# EAGLE design oscilloscope (EAGLE 9.6.2)
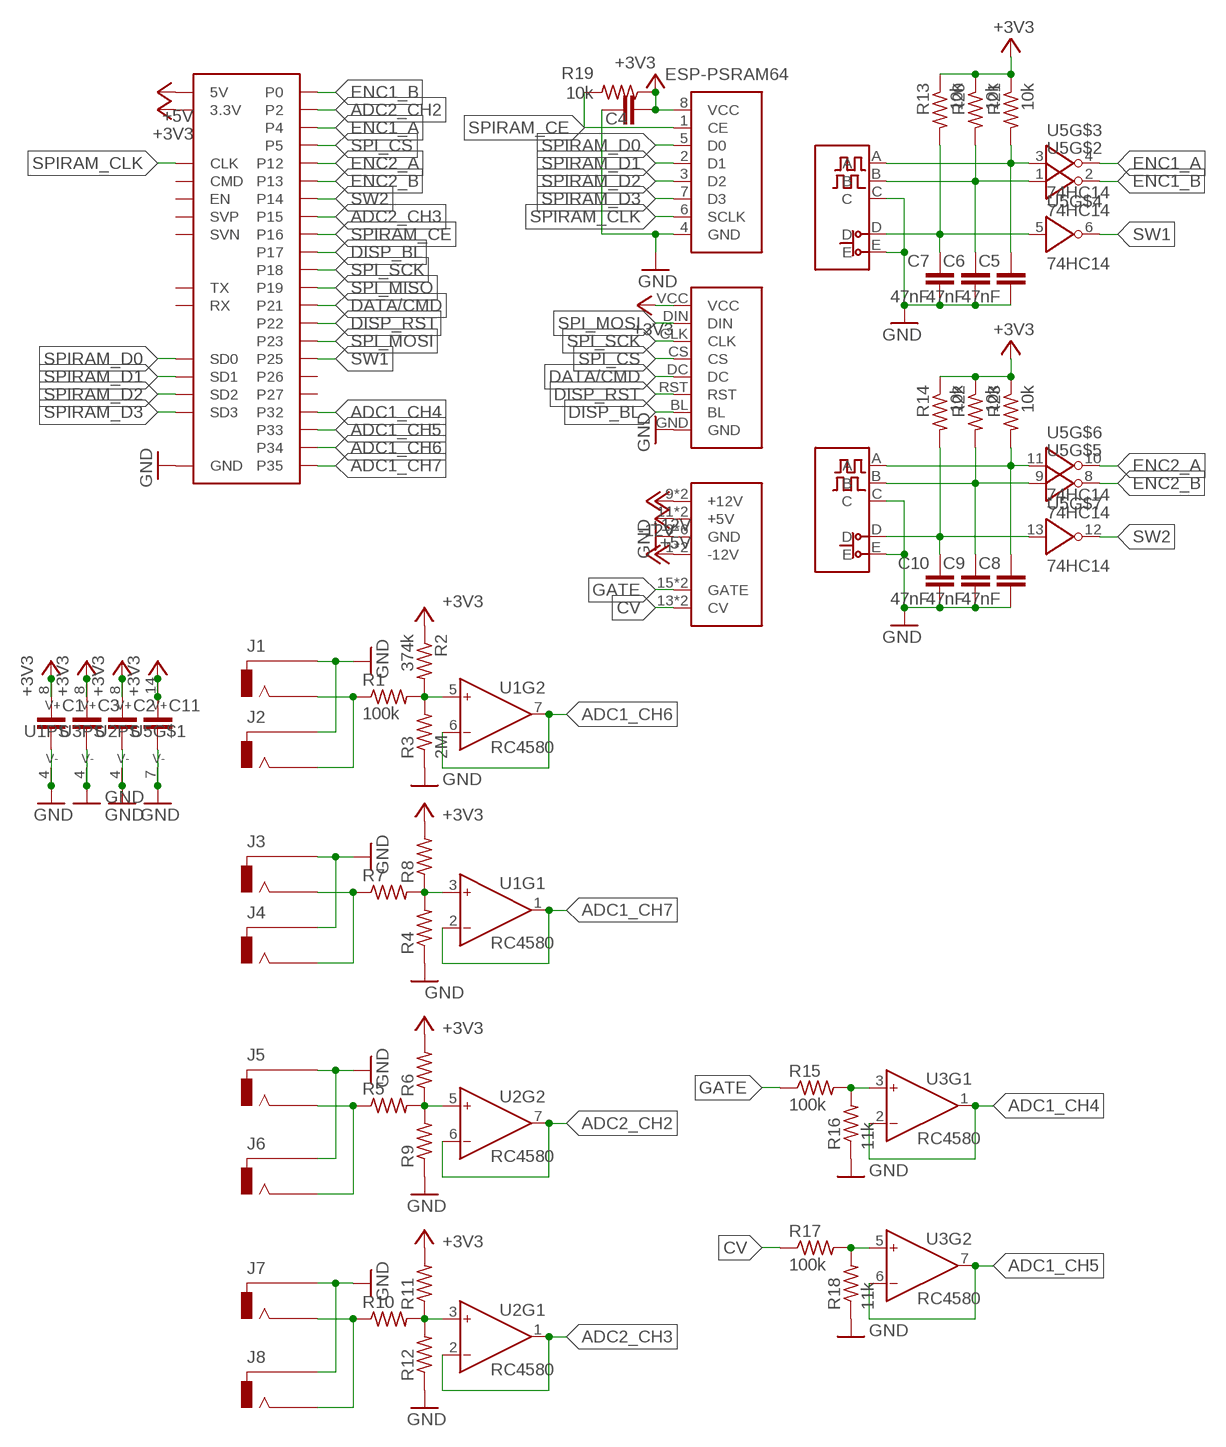
[diagram p0: schematic, sheet 1]

## Parts
C1  C-EUC0805  [C0805]
C2  C-EUC0805  [C0805]
C3  C-EUC0805  [C0805]
C4  C-EUC0805  [C0805]
C5  47nF  C-EUC0805  [C0805]
C6  47nF  C-EUC0805  [C0805]
C7  47nF  C-EUC0805  [C0805]
C8  47nF  C-EUC0805  [C0805]
C9  47nF  C-EUC0805  [C0805]
C10  47nF  C-EUC0805  [C0805]
C11  C-EUC0805  [C0805]
DS1  ST27789_DISPLAY  [ST7789_DISPLAY]
J1  35PM1  [35PM1]
J2  35PM1  [35PM1]
J3  35PM1  [35PM1]
J4  35PM1  [35PM1]
J5  35PM1  [35PM1]
J6  35PM1  [35PM1]
J7  35PM1  [35PM1]
J8  35PM1  [35PM1]
M1  ESP32  [ESP32]
R1  100k  R-US_R0805  [R0805]
R2  374k  R-US_R0805  [R0805]
R3  2M  R-US_R0805  [R0805]
R4  R-US_R0805  [R0805]
R5  R-US_R0805  [R0805]
R6  R-US_R0805  [R0805]
R7  R-US_R0805  [R0805]
R8  R-US_R0805  [R0805]
R9  R-US_R0805  [R0805]
R10  R-US_R0805  [R0805]
R11  R-US_R0805  [R0805]
R12  R-US_R0805  [R0805]
R13  10k  R-US_R0805  [R0805]
R14  10k  R-US_R0805  [R0805]
R15  100k  R-US_R0805  [R0805]
R16  11k  R-US_R0805  [R0805]
R17  100k  R-US_R0805  [R0805]
R18  11k  R-US_R0805  [R0805]
R19  10k  R-US_R0805  [R0805]
R20  10k  R-US_R0805  [R0805]
R21  10k  R-US_R0805  [R0805]
R22  10k  R-US_R0805  [R0805]
R23  10k  R-US_R0805  [R0805]
SW1  EN12-HS  [EN12-HS]
SW2  EN12-HS  [EN12-HS]
U1  RC4580  [SOIC-8]
U2  RC4580  [SOIC-8]
U3  RC4580  [SOIC-8]
U4  ESP-PSRAM64  [SOIC-8]
U5  74HC14  [SOIC127P600X175-14N]
U$1  EURORACK  [302-S161]

## Nets
+3V3: C1.1 C2.1 C3.1 C4.2 C11.1 DS1.VCC M1.X0(3.3V) R2.1 R6.2 R8.2 R11.2 R13.1 R14.1 R19.1 R20.1 R21.1 R22.1 R23.1 U1.8(PS:V+) U2.8(PS:V+) U3.8(PS:V+) U4.8(VCC) U5.14(V+)
+5V: M1.X18(5V) U$1.11(+5V) U$1.12(+5V)
+12V: U$1.9(+12V) U$1.10(+12V)
-12V: U$1.1(-12V) U$1.2(-12V)
ADC1_CH4: M1.X6(P32) U3.1(OUT) U3.2(IN-)
ADC1_CH5: M1.X7(P33) U3.6(IN-) U3.7(OUT)
ADC1_CH6: M1.X4(P34) U1.6(IN-) U1.7(OUT)
ADC1_CH7: M1.X5(P35) U1.1(OUT) U1.2(IN-)
ADC2_CH2: M1.X23(P2) U2.6(IN-) U2.7(OUT)
ADC2_CH3: M1.X22(P15) U2.1(OUT) U2.2(IN-)
CV: R17.1 U$1.13(CV) U$1.14(CV)
DATA/CMD: DS1.DC M1.X32(P21)
DISP_BL: DS1.BL M1.X27(P17)
DISP_RST: DS1.RST M1.X35(P22)
ENC1_A: M1.X25(P4) U5.4(O)
ENC1_A_I: C5.1 R21.2 SW1.A U5.3(I)
ENC1_B: M1.X24(P0) U5.2(O)
ENC1_B_I: C6.1 R20.2 SW1.B U5.1(I)
ENC2_A: M1.X12(P12) U5.10(O)
ENC2_A_I: C8.1 R23.2 SW2.A U5.11(I)
ENC2_B: M1.X14(P13) U5.8(O)
ENC2_B_I: C9.1 R22.2 SW2.B U5.9(I)
GATE: R15.1 U$1.15(GATE) U$1.16(GATE)
GND: C1.2 C2.2 C3.2 C4.1 C5.2 C6.2 C7.2 C8.2 C9.2 C10.2 C11.2 DS1.GND J1.SLEEVE J2.SLEEVE J3.SLEEVE J4.SLEEVE J5.SLEEVE J6.SLEEVE J7.SLEEVE J8.SLEEVE M1.X13(GND) M1.X31(GND) M1.X37(GND) R3.1 R4.1 R9.1 R12.1 R16.1 R18.1 SW1.C SW1.E SW2.C SW2.E U1.4(PS:V-) U2.4(PS:V-) U3.4(PS:V-) U4.4(GND) U5.7(V-) U$1.3(GND) U$1.4(GND) U$1.5(GND) U$1.6(GND) U$1.7(GND) U$1.8(GND)
N$1: R1.2 R2.2 R3.2 U1.5(IN+)
N$2: J1.TIP J2.TIP R1.1
N$3: J3.TIP J4.TIP R7.1
N$4: R5.2 R6.1 R9.2 U2.5(IN+)
N$5: J5.TIP J6.TIP R5.1
N$6: R4.2 R7.2 R8.1 U1.3(IN+)
N$7: R10.2 R11.1 R12.2 U2.3(IN+)
N$8: J7.TIP J8.TIP R10.1
N$9: R15.2 R16.2 U3.3(IN+)
N$11: R17.2 R18.2 U3.5(IN+)
SPI_CS: DS1.CS M1.X28(P5)
SPI_MISO: M1.X30(P19)
SPI_MOSI: DS1.DIN M1.X36(P23)
SPI_SCK: DS1.CLK M1.X29(P18)
SPIRAM_CE: M1.X26(P16) R19.2 U4.1(CE)
SPIRAM_CLK: M1.X19(CLK) U4.6(SCLK)
SPIRAM_D0: M1.X20(SD0) U4.5(D0)
SPIRAM_D1: M1.X21(SD1) U4.2(D1)
SPIRAM_D2: M1.X15(SD2) U4.3(D2)
SPIRAM_D3: M1.X16(SD3) U4.7(D3)
SW1: M1.X8(P25) U5.6(O)
SW1_I: C7.1 R13.2 SW1.D U5.5(I)
SW2: M1.X11(P14) U5.12(O)
SW2_I: C10.1 R14.2 SW2.D U5.13(I)
Unconnected: M1.X1(EN) M1.X2(SVP) M1.X3(SVN) M1.X9(P26) M1.X10(P27) M1.X17(CMD) M1.X33(RX) M1.X34(TX)

## Library data of the parts
C1-C11 = rcl:C-EU: CAPACITOR, European symbol; SPICEPREFIX: C
DS1 = artysynth:ST27789_DISPLAY
J1-J8 = artysynth:35PM1
M1 = artysynth:ESP32
R1-R23 = rcl:R-US_: RESISTOR, American symbol; SPICEPREFIX: R
SW1 SW2 = artysynth:EN12-HS
U1-U3 = artysynth:RC4580
U4 = artysynth:ESP-PSRAM64
U5 = artysynth:74HC14
U$1 = artysynth:EURORACK

## Board
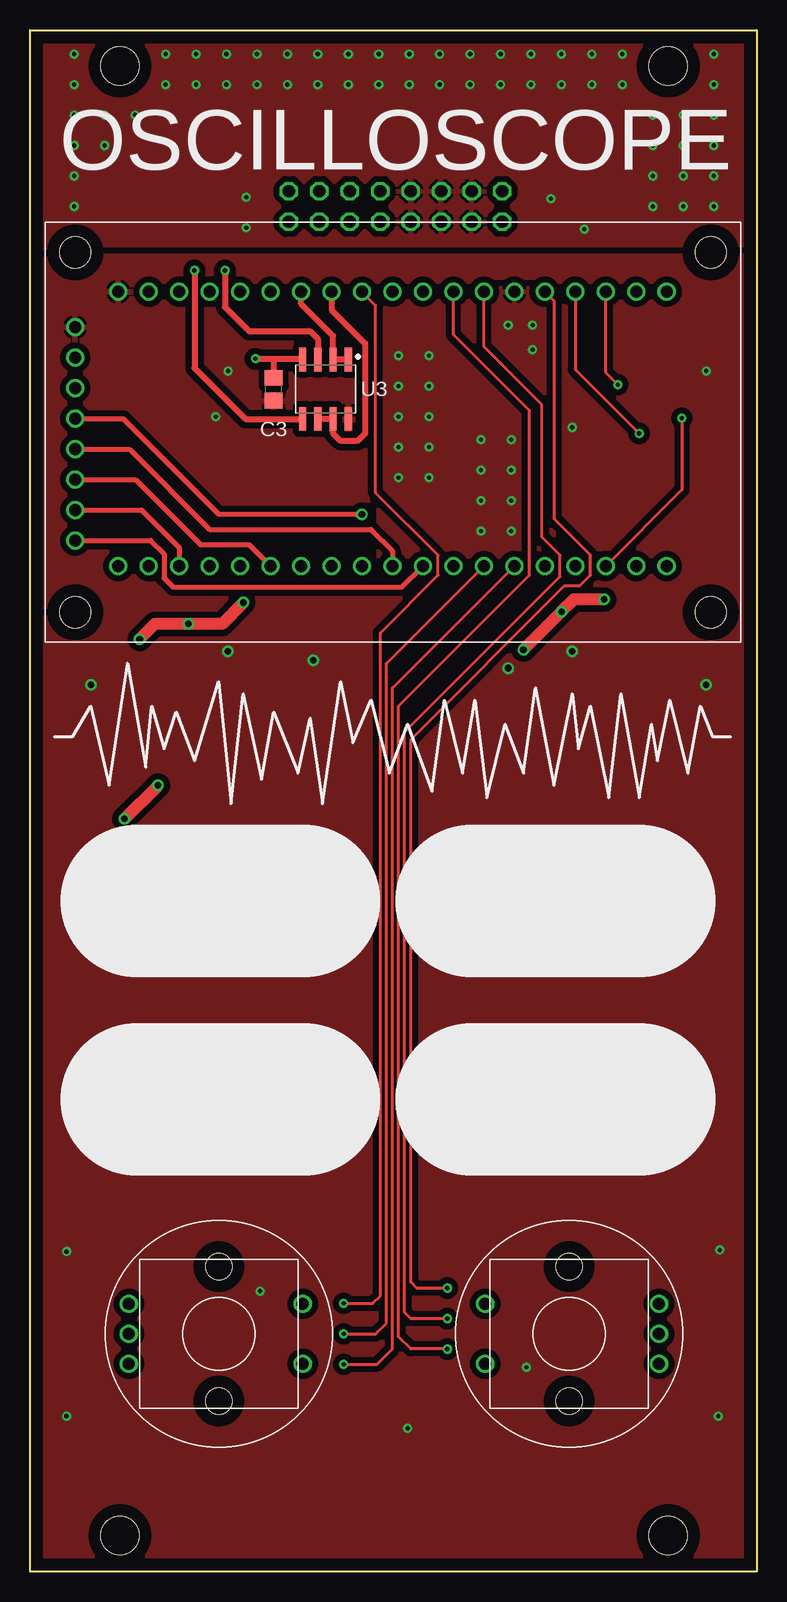
[diagram p1: board, top side]
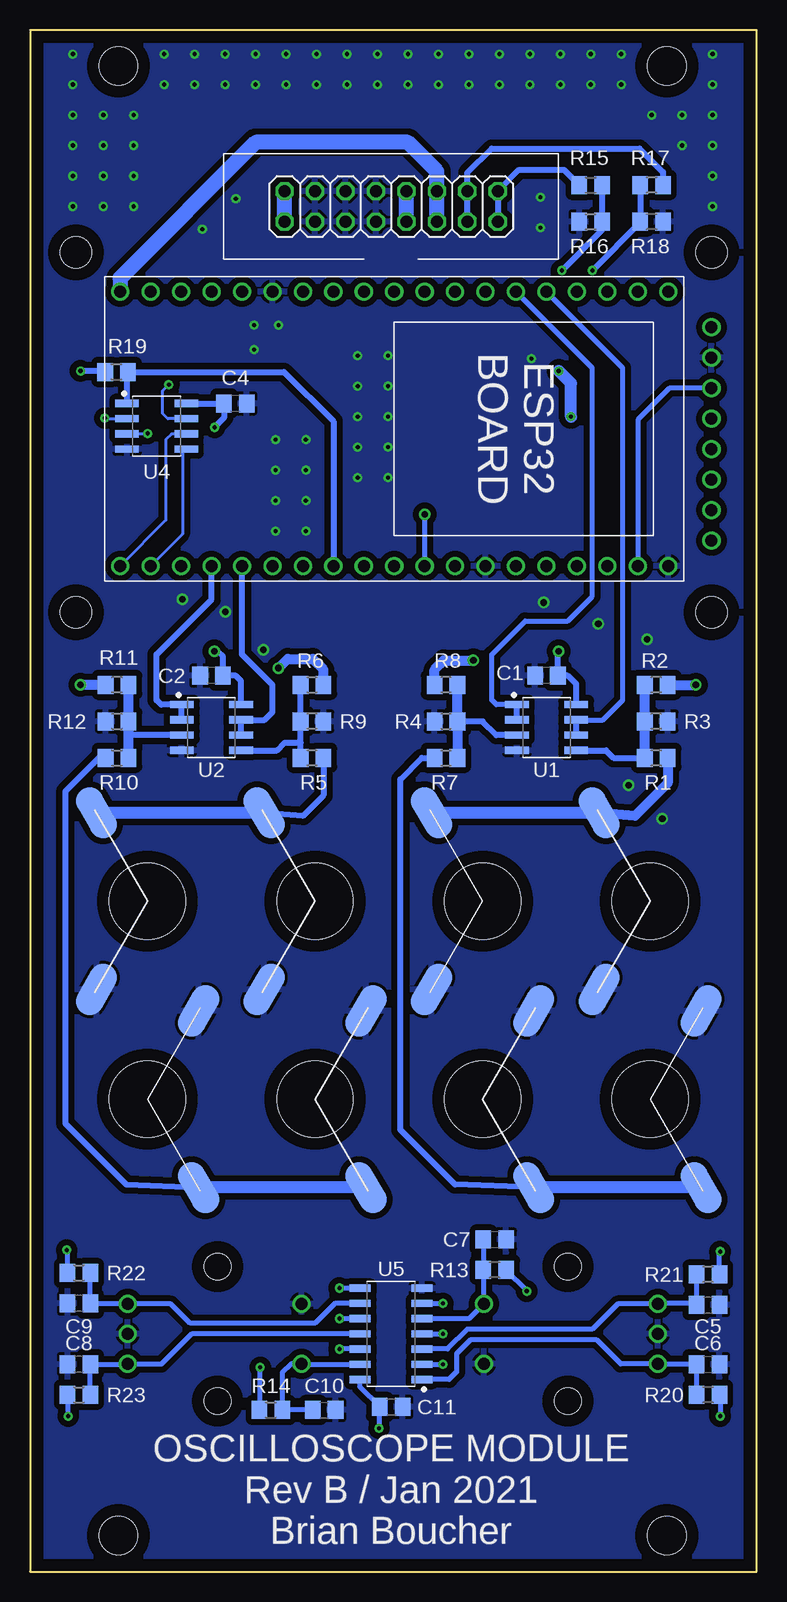
[diagram p2: board, bottom side, seen from below]

Size 60.6 x 128.5 mm. Coordinates in mm from the lower left corner, seen from the top.
Outline: 0,0 0,128.5 60.6,128.5 60.6,0 0,0
Copper layers (1*16): Top 0.035mm / dielectric 1.5mm / Bottom 0.035mm
Design rules "default *": minimum track width 6mil, minimum drill 0.35mm, track to track 6mil, track to pad 6mil, pad to pad 6mil, via to via 6mil, smd to smd 6mil, copper to edge 40mil, drill to drill 6mil, minimum pad ring 10mil, minimum via ring 8mil, stop-mask expansion 4mil, vias tented up to drill 25mil, thermal gap 10mil
Holes 3.2 mm at 7.5,125.5 53.22,125.5 7.5,3 53.22,3

### Footprints (pad centres in the part's own frame; a part is rotated, then mirrored left to right if it is on the bottom)
C0805 = smd 1.3 x 1.5: 1 -0.95,0; 2 0.95,0
ST7789_DISPLAY = drill 1: BL 2.5,8.47; CLK 2.5,18.63; CS 2.5,16.09; DC 2.5,13.55; DIN 2.5,21.17; GND 2.5,23.71; RST 2.5,11.01; VCC 2.5,26.25 | hole 2.6: 2.5,2.5; 2.5,32.5; 55.5,32.5; 55.5,2.5
35PM1 = smd 4.572 x 2.286 rotated 30 bottom: SLEEVE -7.366,-4.253 | smd 4.572 x 2.286 rotated 330 bottom: TIP 7.366,-4.253 | hole 6.35: 0,0
ESP32 = drill 1: X0 0,0; X1 0,-2.54; X2 0,-5.08; X3 0,-7.62; X4 0,-10.16; X5 0,-12.7; X6 0,-15.24; X7 0,-17.78; X8 0,-20.32; X9 0,-22.86; X10 0,-25.4; X11 0,-27.94; X12 0,-30.48; X13 0,-33.02; X14 0,-35.56; X15 0,-38.1; X16 0,-40.64; X17 0,-43.18; X18 0,-45.72; X19 22.86,-45.72; X20 22.86,-43.18; X21 22.86,-40.64; X22 22.86,-38.1; X23 22.86,-35.56; X24 22.86,-33.02; X25 22.86,-30.48; X26 22.86,-27.94; X27 22.86,-25.4; X28 22.86,-22.86; X29 22.86,-20.32; X30 22.86,-17.78; X31 22.86,-15.24; X32 22.86,-12.7; X33 22.86,-10.16; X34 22.86,-7.62; X35 22.86,-5.08; X36 22.86,-2.54; X37 22.86,0
R0805 = smd 1.3 x 1.5: 1 -0.95,0; 2 0.95,0
EN12-HS = drill 1: A -2.5,-7.5; B 2.5,-7.5; C 0,-7.5; D -2.5,7; E 2.5,7 | hole 2.2: -5.6,0; 5.6,0
SOIC-8 = smd 1.965 x 0.602: 1 -2.47,1.905; 2 -2.47,0.635; 3 -2.47,-0.635; 4 -2.47,-1.905; 5 2.47,-1.905; 6 2.47,-0.635; 7 2.47,0.635; 8 2.47,1.905
SOIC127P600X175-14N = smd 1.746 x 0.592: 1 -2.585,3.81; 2 -2.585,2.54; 3 -2.585,1.27; 4 -2.585,0; 5 -2.585,-1.27; 6 -2.585,-2.54; 7 -2.585,-3.81; 8 2.585,-3.81; 9 2.585,-2.54; 10 2.585,-1.27; 11 2.585,0; 12 2.585,1.27; 13 2.585,2.54; 14 2.585,3.81
302-S161 = drill 1.016 octagon: 1 -8.89,-1.27; 2 -8.89,1.27; 3 -6.35,-1.27; 4 -6.35,1.27; 5 -3.81,-1.27; 6 -3.81,1.27; 7 -1.27,-1.27; 8 -1.27,1.27; 9 1.27,-1.27; 10 1.27,1.27; 11 3.81,-1.27; 12 3.81,1.27; 13 6.35,-1.27; 14 6.35,1.27; 15 8.89,-1.27; 16 8.89,1.27

### Placement (x,y rotation side)
C1  17.53,74.68 180 bottom
C2  45.47,74.68 180 bottom
C3  20.32,98.55 90 top
C4  43.47,97.36 180 bottom
C5  4.06,22.23 0 bottom
C6  4.06,17.27 0 bottom
C7  21.84,27.69 0 bottom
C8  56.52,17.27 180 bottom
C9  56.52,22.35 180 bottom
C10  36.07,13.46 0 bottom
C11  30.48,13.72 0 bottom
DS1  1.27,77.47 0 top
J1  8.89,55.88 90 top
J2  22.86,55.88 90 top
J3  22.86,39.37 270 top
J4  8.89,39.37 270 top
J5  50.8,55.88 90 top
J6  36.83,55.88 90 top
J7  36.83,39.37 270 top
J8  50.8,39.37 270 top
M1  7.37,106.68 270 bottom
R1  8.38,67.82 180 bottom
R2  8.38,73.91 180 bottom
R3  8.38,70.87 180 bottom
R4  25.91,70.87 0 bottom
R5  37.08,67.82 180 bottom
R6  37.08,73.91 0 bottom
R7  25.91,67.82 0 bottom
R8  25.91,73.91 180 bottom
R9  37.08,70.87 180 bottom
R10  53.34,67.82 0 bottom
R11  53.34,73.91 180 bottom
R12  53.34,70.87 0 bottom
R13  21.84,25.15 180 bottom
R14  40.51,13.46 0 bottom
R15  13.84,115.57 0 bottom
R16  13.84,112.52 0 bottom
R17  8.76,115.57 180 bottom
R18  8.76,112.52 180 bottom
R19  53.38,99.99 0 bottom
R20  4.06,14.73 180 bottom
R21  4.06,24.77 180 bottom
R22  56.52,24.89 0 bottom
R23  56.52,14.73 0 bottom
SW1  15.75,19.81 270 top
SW2  44.96,19.81 90 top
U1  17.53,70.36 0 bottom
U2  45.47,70.36 0 bottom
U3  24.64,98.55 270 top
U4  50.03,95.47 0 bottom
U5  30.48,19.81 180 bottom
U$1  30.48,113.79 0 bottom

### Tracks (layer width: path | path; a pad name or v marks a point on that pad's centre or on a via)
+3V3  (via drill 0.35, 0.55)
  Bottom 0.406: R21.1 3.11,26.6 v3.05,26.67 | R20.1 3.05,14.67 v3.05,12.95 | R13.1 19.18,23.43 v19.18,23.37 | v41.4,17.02 41.46,16.96 R14.1 | R22.1 57.47,26.73 v57.53,26.8 | R23.1 57.47,13.02 v57.4,12.95 | U5.14 33.06,15.35 C11.1 31.5,13.65 v31.5,11.94
  Bottom 0.508: U1.8 15.06,73.98 15.75,74.68 C1.1 16.58,76.64 v16.51,76.71 | U2.8 43,74.24 43.43,74.68 C2.1 44.52,76.27 44.96,76.71 v45.21,76.71 | U4.8 44.44,97.37 C4.2 44.42,96.17 v45.21,95.38 | R19.1 54.41,100.08 v56.39,100.08
  Bottom 0.813: R2.1 v5.08,73.91 | R8.2 26.86,75.18 26.1,75.95 v23.62,75.95 | v39.88,75.31 39.12,76.07 37.02,76.07 36.13,75.18 R6.2 | R11.2 v56.39,73.91
  Bottom 1.016: v15.49,96.27 15.49,99.06 v16.51,100.08
  pour Top (isolate 0.508, rank 2): 0,0 60.71,0 60.71,109.6 0,109.6
+5V
  Bottom 1.27: U$1.11 U$1.12 26.67,116.71 29.08,119.13 41.78,119.13 53.09,107.82 M1.X18
+12V
  Bottom 1.27: U$1.9 U$1.10
-12V
  Bottom 1.27: U$1.1 U$1.2
ADC1_CH4
  Top 0.508: U3.1 U3.2 25.27,103 22.61,105.66 M1.X6
ADC1_CH5
  Top 0.508: M1.X7 25.15,105.16 27.94,102.36 27.94,94.87 27.3,94.23 25.91,94.23 25.27,94.87 U3.7 U3.6
ADC1_CH6
  Bottom 0.406: U1.7 12.83,70.99 11.18,72.64 11.18,100.33 M1.X4
  Bottom 0.508: U1.6 U1.7
ADC1_CH7
  Bottom 0.406: U1.1 21.72,72.26 22.1,72.64 22.1,76.45 19.3,79.25 15.75,79.25 13.72,81.28 13.72,100.33 M1.X5
  Bottom 0.508: U1.2 U1.1
ADC2_CH2
  Bottom 0.508: U2.6 U2.7 41.02,70.99 40.39,71.63 40.39,73.91 42.93,76.45 M1.X23
ADC2_CH3
  Bottom 0.508: U2.2 U2.1 49.66,72.26 50.04,72.64 50.04,76.45 45.47,81.03 M1.X22
CV
  Bottom 0.508: U$1.13 U$1.14 24.13,116.59 22.1,118.62 9.78,118.62 7.81,116.65 R17.1
DATA/CMD
  Top 0.406: DS1.DC 8.8,91.02 14.22,85.6 18.29,85.6 M1.X32
DISP_BL
  Top 0.406: DS1.BL 10.07,85.94 11.18,84.84 11.18,82.8 11.94,82.04 30.99,82.04 M1.X27
DISP_RST
  Top 0.406: DS1.RST 9.31,88.48 12.45,85.34 M1.X35
ENC1_A  (via drill 0.35)
  Top 0.254: v26.16,19.81 28.83,19.81 29.72,20.7 29.72,75.69 M1.X25
  Bottom 0.406: U5.4 v26.16,19.81
ENC1_A_I
  Bottom 0.406: R21.2 C5.1 5.14,22.35 8.21,22.35 SW1.A 11.6,22.31 13.72,20.19 24.13,20.19 25.78,18.54 U5.3
ENC1_B  (via drill 0.35)
  Top 0.254: v26.16,17.27 28.96,17.27 30.23,18.54 30.23,73.66 M1.X24
  Bottom 0.406: U5.2 v26.16,17.27
ENC1_B_I
  Bottom 0.406: R20.2 C6.1 8.21,17.27 SW1.B 11.34,17.31 13.34,19.3 23.88,19.3 25.02,18.16 25.02,16.64 25.65,16 U5.1
ENC2_A  (via drill 0.35)
  Top 0.254: v34.8,21.08 31.75,21.08 31.24,21.59 31.24,69.98 44.2,82.93 44.2,84.71 42.67,86.23 42.67,97.28 37.85,102.11 M1.X12
  Bottom 0.406: U5.10 v34.8,21.08
ENC2_A_I
  Bottom 0.406: R23.2 C8.1 52.5,17.27 | 52.5,17.27 SW2.A | U5.11 47.12,19.81 49.66,17.27 52.5,17.27
ENC2_B  (via drill 0.35)
  Top 0.254: v34.8,23.62 32.26,23.62 31.75,24.13 31.75,69.34 44.58,82.17 45.85,82.17 46.74,83.06 46.74,84.71 43.69,87.76 43.69,105.92 M1.X14
  Bottom 0.406: U5.8 v34.8,23.62
ENC2_B_I
  Bottom 0.406: R22.2 C9.1 55.52,22.31 SW2.B 48.85,22.31 47.24,20.7 36.83,20.7 35.18,22.35 U5.9
GATE
  Bottom 0.508: R15.1 16.06,116.84 19.81,116.84 U$1.16 U$1.15
GND  (via drill 0.35, 0.55)
  Top 0.508: v18.8,101.09 20.32,101.09 | 20.32,101.09 C3.2 | 20.32,101.09 22.73,101.09 U3.4
  Top 1.016: v7.87,62.74 v10.67,65.53 | v9.14,77.72 10.41,78.99 v13.21,78.99 16,78.99 v17.78,80.77 | v41.15,76.83 v44.32,80.01 45.34,81.03 v47.88,81.03
  other vias: 30.73,101.35 37.59,94.36 37.59,91.82 37.59,89.28 37.59,86.74 40.13,94.36 40.13,91.82 40.13,89.28 40.13,86.74 33.27,101.35 33.27,98.81 33.27,96.27 33.27,93.73 33.27,91.19 30.73,91.19 30.73,93.73 30.73,96.27 30.73,98.81 39.88,103.89 41.91,103.89 41.91,101.85 46.23,111.89 43.43,114.43 3.68,113.79 3.68,116.33 3.68,118.87 3.68,121.41 6.22,121.41 6.22,118.87 8.76,121.41 11.3,123.95 13.84,123.95 11.3,126.49 13.84,126.49 3.68,123.95 3.68,126.49 16.38,123.95 16.38,126.49 18.92,126.49 18.92,123.95 21.46,123.95 21.46,126.49 24,123.95 26.54,123.95 24,126.49 26.54,126.49 29.08,123.95 29.08,126.49 31.62,126.49 31.62,123.95 34.16,123.95 34.16,126.49 36.7,126.49 36.7,123.95 39.24,123.95 39.24,126.49 41.78,123.95 44.32,123.95 41.78,126.49 44.32,126.49 46.86,123.95 46.86,126.49 49.4,126.49 49.4,123.95 51.94,121.41 54.48,121.41 57.02,121.41 57.02,123.95 57.02,126.49 51.94,118.87 54.48,118.87 57.02,118.87 51.94,116.33 54.48,116.33 57.02,116.33 51.94,113.79 54.48,113.79 57.02,113.79 18.03,114.55 18.03,112.01
  pour Bottom (isolate 0.508): 0,0 60.96,0 60.96,129.54 0,129.54
  pour Top (isolate 0.508): 29.08,106.93 29.08,84.07 43.69,84.07 43.69,106.93
  pour Top (isolate 0.508, rank 4): 0,107.7 0,128.52 60.58,128.52 60.58,107.7
N$1
  Bottom 0.508: U1.5 12.57,68.45 11.94,67.82 R1.2
  Bottom 0.813: R1.2 R3.2 R2.2
N$2
  Bottom 0.813: R1.1 7.43,65.72 10.16,62.99 J1.TIP
  Bottom 1.016: J1.TIP J2.TIP
N$3
  Bottom 0.508: J3.TIP 25.15,32.26 29.72,36.83 29.72,66.04 27.94,67.82 R7.1
  Bottom 1.016: J4.TIP J3.TIP
N$4
  Bottom 0.508: R5.2 38.03,69.09 | 38.03,69.09 R9.2 R6.1 | U2.5 40.01,68.45 39.37,69.09 38.03,69.09
N$5
  Bottom 0.508: R5.1 36.13,64.7 37.85,62.99 J6.TIP
  Bottom 1.016: J6.TIP J5.TIP
N$6
  Bottom 0.508: U1.3 21.72,69.72 22.86,70.87 R4.2
  Bottom 0.813: R8.1 R4.2 R7.2
N$7
  Bottom 0.508: U2.3 52.26,69.72 52.39,69.85
  Bottom 0.813: R10.2 52.39,69.85 R12.2 R11.1
N$8
  Bottom 0.508: R10.1 54.86,67.82 57.66,65.02 57.66,37.34 52.58,32.26 J8.TIP
  Bottom 1.016: J7.TIP J8.TIP
N$9  (via drill 0.35)
  Top 0.508: v16.26,108.46 16.26,105.41 18.29,103.38 23.37,103.38 24,102.74 U3.3
  Bottom 0.508: R15.2 R16.2 12.89,111.82 v16.26,108.46
N$11  (via drill 0.35)
  Top 0.508: v13.72,108.46 13.72,100.33 17.96,96.08 U3.5
  Bottom 0.508: R17.2 R18.2 9.71,112.46 v13.72,108.46
SPI_CS
  Top 0.406: DS1.CS 8.29,93.56 14.99,86.87 28.45,86.87 30.23,85.09 M1.X28
SPI_MOSI
  Bottom 0.406: DS1.DIN 7.28,98.64 9.91,96.01 M1.X36
SPI_SCK  (via drill 0.55)
  Top 0.406: DS1.CLK 7.79,96.1 15.75,88.14 v27.69,88.14
  Bottom 0.406: v27.69,88.14 M1.X29
SPIRAM_CE
  Bottom 0.508: U4.1 52.5,99.92 R19.2 39.41,99.99 35.31,95.89 M1.X26
SPIRAM_CLK
  Bottom 0.254: U4.6 48.81,94.83 49.28,94.36 49.28,87.63 M1.X19
SPIRAM_D0
  Bottom 0.254: U4.5 47.88,93.56 47.88,86.49 M1.X20
SPIRAM_D1  (via drill 0.35)
  Top 0.254: M1.X21 54.36,90.17 v54.36,96.14
  Bottom 0.254: v54.36,96.14 54.32,96.1 U4.2
SPIRAM_D2  (via drill 0.35)
  Top 0.254: M1.X15 45.47,100.2 v50.8,94.87
  Bottom 0.254: U4.3 52.47,94.87 v50.8,94.87
SPIRAM_D3  (via drill 0.35)
  Top 0.254: v49.02,98.93 48.01,99.95 M1.X16
  Bottom 0.254: U4.7 49.11,96.1 49.53,96.52 49.53,98.42 v49.02,98.93
SW1  (via drill 0.35)
  Top 0.254: v26.16,22.35 28.57,22.35 29.21,22.99 29.21,78.23 34.04,83.06 34.04,84.71 28.83,89.92 28.83,105.54 M1.X8
  Bottom 0.406: U5.6 v26.16,22.35
SW1_I
  Bottom 0.406: C7.1 R13.2 22.75,25.15 SW1.D 23.98,21.08 U5.5
SW2  (via drill 0.35)
  Top 0.254: M1.X11 35.31,103.12 41.66,96.77 41.66,83.06 30.73,72.14 30.73,19.56 31.75,18.54 v34.8,18.54
  Bottom 0.406: U5.12 v34.8,18.54
SW2_I
  Bottom 0.406: C10.1 R14.2 39.56,16.6 38.85,17.31 SW2.D 37.92,17.27 U5.13

### Text on the board
tPlace: OSCILLOSCOPE
bPlace: OSCILLOSCOPE MODULE / Rev B / Jan 2021 / Brian Boucher